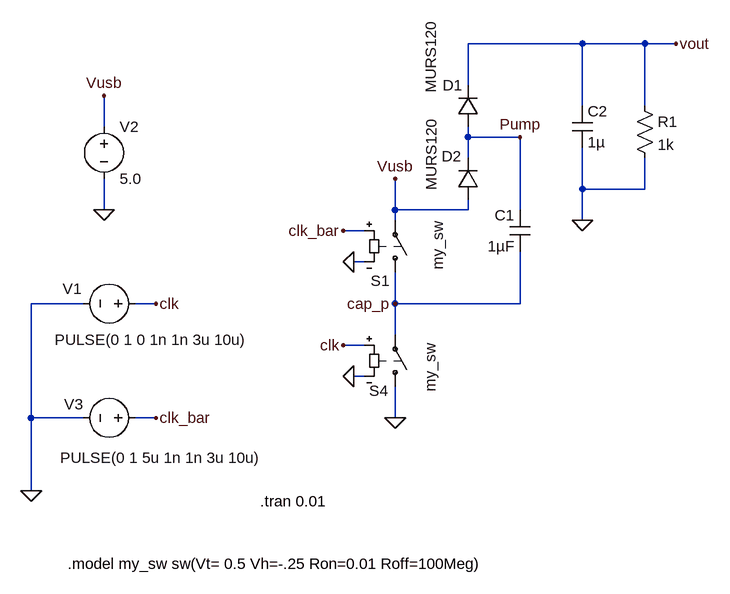
[diagram p0: schematic switch_cap_pump_doubler.asc]
switch_cap_pump_doubler.asc, the LTspice schematic file:
Version 4
SHEET 1 1348 696
WIRE 656 -800 480 -800
WIRE 752 -800 656 -800
WIRE 800 -800 752 -800
WIRE 480 -736 480 -800
WIRE 656 -704 656 -800
WIRE 752 -704 752 -800
WIRE -80 -672 -80 -720
WIRE 480 -656 480 -672
WIRE 560 -656 480 -656
WIRE 480 -624 480 -656
WIRE 656 -576 656 -640
WIRE 752 -576 752 -624
WIRE 752 -576 656 -576
WIRE -80 -544 -80 -592
WIRE 368 -544 368 -592
WIRE 480 -544 480 -560
WIRE 480 -544 368 -544
WIRE 560 -544 560 -656
WIRE 368 -528 368 -544
WIRE 656 -528 656 -576
WIRE 320 -512 288 -512
WIRE 320 -464 304 -464
WIRE -112 -400 -192 -400
WIRE 0 -400 -32 -400
WIRE 368 -400 368 -448
WIRE 560 -400 560 -480
WIRE 560 -400 368 -400
WIRE 368 -352 368 -400
WIRE 320 -336 288 -336
WIRE 320 -288 304 -288
WIRE -192 -224 -192 -400
WIRE -112 -224 -192 -224
WIRE 0 -224 -32 -224
WIRE 368 -224 368 -272
WIRE -192 -112 -192 -224
FLAG 0 -400 clk
FLAG 304 -464 0
FLAG 288 -512 clk_bar
FLAG -80 -544 0
FLAG -80 -720 Vusb
FLAG 368 -592 Vusb
FLAG 656 -528 0
FLAG -192 -112 0
FLAG 0 -224 clk_bar
FLAG 368 -400 cap_p
FLAG 304 -288 0
FLAG 288 -336 clk
FLAG 368 -224 0
FLAG 800 -800 vout
FLAG 560 -656 Pump
SYMBOL sw 368 -432 M180
WINDOW 0 -38 3 Left 2
WINDOW 3 66 95 VLeft 2
SYMATTR InstName S1
SYMATTR Value my_sw
SYMBOL voltage -16 -400 R90
WINDOW 123 0 0 Left 2
WINDOW 39 0 0 Left 2
WINDOW 3 56 -157 VRight 2
WINDOW 0 -23 98 VRight 2
SYMATTR Value PULSE(0 1 0 1n 1n 3u 10u)
SYMATTR InstName V1
SYMBOL cap 576 -480 R180
WINDOW 0 24 56 Left 2
WINDOW 3 24 8 Left 2
SYMATTR InstName C1
SYMATTR Value 1µF
SYMBOL voltage -80 -688 R0
WINDOW 123 0 0 Left 2
WINDOW 39 0 0 Left 2
SYMATTR InstName V2
SYMATTR Value 5.0
SYMBOL cap 640 -704 R0
SYMATTR InstName C2
SYMATTR Value 1µ
SYMBOL voltage -16 -224 R90
WINDOW 123 0 0 Left 2
WINDOW 39 0 0 Left 2
WINDOW 3 61 -179 VRight 2
WINDOW 0 -21 96 VRight 2
SYMATTR Value PULSE(0 1 5u 1n 1n 3u 10u)
SYMATTR InstName V3
SYMBOL sw 368 -256 M180
WINDOW 0 -40 10 Left 2
WINDOW 3 54 8 VRight 2
SYMATTR InstName S4
SYMATTR Value my_sw
SYMBOL res 736 -720 R0
SYMATTR InstName R1
SYMATTR Value 1k
SYMBOL diode 496 -672 R180
WINDOW 0 24 64 Left 2
WINDOW 3 73 52 VRight 2
SYMATTR InstName D1
SYMATTR Value MURS120
SYMBOL diode 496 -560 R180
WINDOW 0 26 67 Left 2
WINDOW 3 72 14 VRight 2
SYMATTR InstName D2
SYMATTR Value MURS120
TEXT -136 0 Left 2 !.model my_sw sw(Vt= 0.5 Vh=-.25 Ron=0.01 Roff=100Meg)
TEXT 160 -96 Left 2 !.tran 0.01

The netlist it stands for:
* switch_cap_pump_doubler.asc
S1 cap_p Vusb clk_bar 0 my_sw
V1 clk 0 PULSE(0 1 0 1n 1n 3u 10u)
C1 cap_p Pump 1µF
V2 Vusb 0 5.0
C2 vout 0 1µ
V3 clk_bar 0 PULSE(0 1 5u 1n 1n 3u 10u)
S4 0 cap_p clk 0 my_sw
R1 vout 0 1k
D1 Pump vout MURS120
D2 Vusb Pump MURS120
.model D D
.lib standard.dio
.model my_sw sw(Vt= 0.5 Vh=-.25 Ron=0.01 Roff=100Meg)
.tran 0.01
.backanno
.end